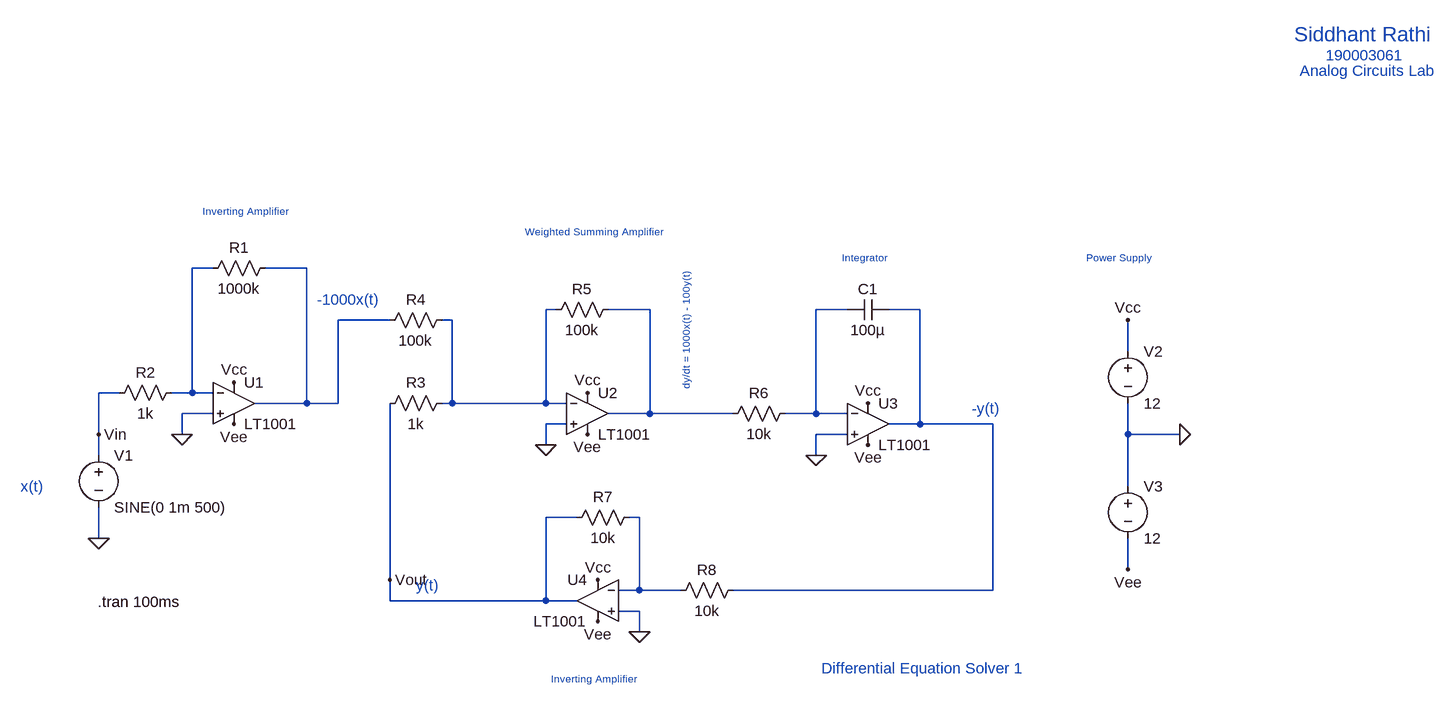
[diagram p0: schematic DifferentialEqnSolver1.asc]
DifferentialEqnSolver1.asc, the LTspice schematic file:
Version 4
SHEET 1 1776 680
WIRE -144 -32 -176 -32
WIRE 0 -32 -64 -32
WIRE 384 32 368 32
WIRE 528 32 464 32
WIRE 832 32 784 32
WIRE 944 32 896 32
WIRE 128 48 48 48
WIRE 224 48 208 48
WIRE 1264 96 1264 48
WIRE -288 160 -320 160
WIRE -176 160 -176 -32
WIRE -176 160 -208 160
WIRE -144 160 -176 160
WIRE 0 176 0 -32
WIRE 0 176 -80 176
WIRE 48 176 48 48
WIRE 48 176 0 176
WIRE 224 176 224 48
WIRE 224 176 208 176
WIRE 368 176 368 32
WIRE 368 176 224 176
WIRE 400 176 368 176
WIRE -144 192 -192 192
WIRE 528 192 528 32
WIRE 528 192 464 192
WIRE 656 192 528 192
WIRE 784 192 784 32
WIRE 784 192 736 192
WIRE 832 192 784 192
WIRE 400 208 368 208
WIRE 944 208 944 32
WIRE 944 208 896 208
WIRE 1056 208 944 208
WIRE -320 224 -320 160
WIRE -192 224 -192 192
WIRE 832 224 784 224
WIRE 1264 224 1264 176
WIRE 1344 224 1264 224
WIRE 368 240 368 208
WIRE -320 256 -320 224
WIRE 784 256 784 224
WIRE 1264 304 1264 224
WIRE 416 352 368 352
WIRE 512 352 496 352
WIRE -320 384 -320 336
WIRE 1264 432 1264 384
WIRE 128 448 128 176
WIRE 512 464 512 352
WIRE 512 464 480 464
WIRE 576 464 512 464
WIRE 1056 464 1056 208
WIRE 1056 464 656 464
WIRE 128 480 128 448
WIRE 368 480 368 352
WIRE 368 480 128 480
WIRE 416 480 368 480
WIRE 512 496 480 496
WIRE 512 528 512 496
FLAG 1344 224 0
FLAG -192 224 0
FLAG -320 384 0
FLAG 368 240 0
FLAG 784 256 0
FLAG 512 528 0
FLAG 1264 48 Vcc
FLAG 864 176 Vcc
FLAG 432 160 Vcc
FLAG -112 144 Vcc
FLAG 448 448 Vcc
FLAG 1264 432 Vee
FLAG 864 240 Vee
FLAG 448 512 Vee
FLAG 432 224 Vee
FLAG -112 208 Vee
FLAG -320 224 Vin
FLAG 128 448 Vout
SYMBOL OpAmps\\LT1001 -112 112 R0
SYMATTR InstName U1
SYMBOL OpAmps\\LT1001 432 128 R0
SYMATTR InstName U2
SYMBOL OpAmps\\LT1001 864 144 R0
SYMATTR InstName U3
SYMBOL OpAmps\\LT1001 448 416 M0
SYMATTR InstName U4
SYMBOL voltage -320 240 R0
WINDOW 123 0 0 Left 0
WINDOW 39 0 0 Left 0
SYMATTR InstName V1
SYMATTR Value SINE(0 1m 500)
SYMBOL voltage 1264 80 R0
WINDOW 123 0 0 Left 0
WINDOW 39 0 0 Left 0
SYMATTR InstName V2
SYMATTR Value 12
SYMBOL voltage 1264 288 R0
WINDOW 123 0 0 Left 0
WINDOW 39 0 0 Left 0
SYMATTR InstName V3
SYMATTR Value 12
SYMBOL res -48 -48 R90
WINDOW 0 0 56 VBottom 2
WINDOW 3 32 56 VTop 2
SYMATTR InstName R1
SYMATTR Value 1000k
SYMBOL res -192 144 R90
WINDOW 0 0 56 VBottom 2
WINDOW 3 32 56 VTop 2
SYMATTR InstName R2
SYMATTR Value 1k
SYMBOL res 224 160 R90
WINDOW 0 0 56 VBottom 2
WINDOW 3 32 56 VTop 2
SYMATTR InstName R3
SYMATTR Value 1k
SYMBOL res 224 32 R90
WINDOW 0 0 56 VBottom 2
WINDOW 3 32 56 VTop 2
SYMATTR InstName R4
SYMATTR Value 100k
SYMBOL res 480 16 R90
WINDOW 0 0 56 VBottom 2
WINDOW 3 32 56 VTop 2
SYMATTR InstName R5
SYMATTR Value 100k
SYMBOL res 752 176 R90
WINDOW 0 0 56 VBottom 2
WINDOW 3 32 56 VTop 2
SYMATTR InstName R6
SYMATTR Value 10k
SYMBOL res 512 336 R90
WINDOW 0 0 56 VBottom 2
WINDOW 3 32 56 VTop 2
SYMATTR InstName R7
SYMATTR Value 10k
SYMBOL res 672 448 R90
WINDOW 0 0 56 VBottom 2
WINDOW 3 32 56 VTop 2
SYMATTR InstName R8
SYMATTR Value 10k
SYMBOL cap 896 16 R90
WINDOW 0 0 32 VBottom 2
WINDOW 3 32 32 VTop 2
SYMATTR InstName C1
SYMATTR Value 100µ
TEXT -322 482 Left 2 !.tran 100ms
TEXT -440 304 Left 2 ;x(t)
TEXT 16 16 Left 2 ;-1000x(t)
TEXT 168 456 Left 2 ;y(t)
TEXT 584 -24 VRight 1 ;dy/dt = 1000x(t) - 100y(t)
TEXT 1024 184 Left 2 ;-y(t)
TEXT 336 -88 Left 1 ;Weighted Summing Amplifier
TEXT 824 -48 Left 1 ;Integrator
TEXT -160 -120 Left 1 ;Inverting Amplifier
TEXT 376 600 Left 1 ;Inverting Amplifier
TEXT 1200 -48 Left 1 ;Power Supply
TEXT 792 584 Left 2 ;Differential Equation Solver 1
TEXT 1520 -392 Left 3 ;Siddhant Rathi
TEXT 1568 -360 Left 2 ;190003061
TEXT 1528 -336 Left 2 ;Analog Circuits Lab

The netlist it stands for:
* DifferentialEqnSolver1.asc
XU1 0 N001 Vcc Vee N002 LT1001  ; pins In+ In- V+ V- OUT
XU2 0 N003 Vcc Vee N004 LT1001  ; pins In+ In- V+ V- OUT
XU3 0 N005 Vcc Vee N006 LT1001  ; pins In+ In- V+ V- OUT
XU4 0 N007 Vcc Vee Vout LT1001  ; pins In+ In- V+ V- OUT
V1 Vin 0 SINE(0 1m 500)
V2 Vcc 0 12
V3 0 Vee 12
R1 N002 N001 1000k
R2 N001 Vin 1k
R3 N003 Vout 1k
R4 N003 N002 100k
R5 N004 N003 100k
R6 N005 N004 10k
R7 N007 Vout 10k
R8 N006 N007 10k
C1 N006 N005 100µ
.tran 100ms
* x(t)
* -1000x(t)
* y(t)
* dy/dt = 1000x(t) - 100y(t)
* -y(t)
* Weighted Summing Amplifier
* Integrator
* Inverting Amplifier
* Inverting Amplifier
* Power Supply
* Differential Equation Solver 1
* Siddhant Rathi
* 190003061
* Analog Circuits Lab
.lib LTC.lib
.backanno
.end